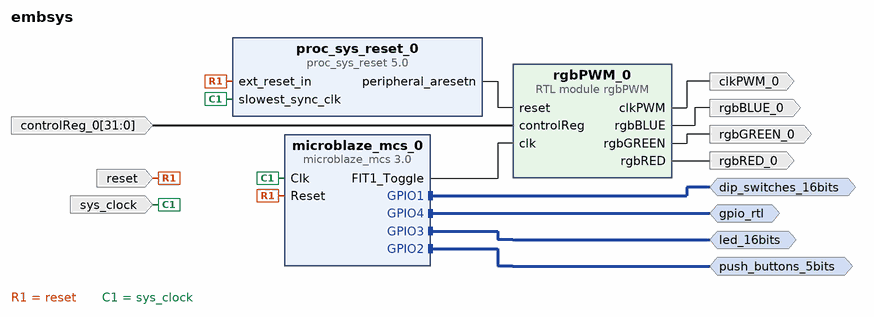
[diagram p0: block diagram of the top level]
# Vivado block design embsys, xc7a100tcsg324-1, Vivado 2024.1
create_bd_design embsys

create_bd_intf_port -mode Master -vlnv xilinx.com:interface:gpio_rtl:1.0 dip_switches_16bits
create_bd_intf_port -mode Master -vlnv xilinx.com:interface:gpio_rtl:1.0 push_buttons_5bits
create_bd_intf_port -mode Master -vlnv xilinx.com:interface:gpio_rtl:1.0 led_16bits
create_bd_intf_port -mode Master -vlnv xilinx.com:interface:gpio_rtl:1.0 gpio_rtl
create_bd_port -dir I -type clk sys_clock
set_property -dict {CONFIG.FREQ_HZ 100000000 CONFIG.PHASE 0.0} [get_bd_ports sys_clock]
create_bd_port -dir I -type rst reset
set_property -dict {CONFIG.POLARITY ACTIVE_LOW} [get_bd_ports reset]
create_bd_port -dir O clkPWM_0
create_bd_port -dir I -from 31 -to 0 controlReg_0
create_bd_port -dir O rgbBLUE_0
create_bd_port -dir O rgbGREEN_0
create_bd_port -dir O rgbRED_0

create_bd_cell -type ip -vlnv xilinx.com:ip:microblaze_mcs:3.0 microblaze_mcs_0
set_property -dict [list \
  CONFIG.CLK_BOARD_INTERFACE sys_clock \
  CONFIG.DEBUG_ENABLED 2 \
  CONFIG.FIT1_No_CLOCKS 500 \
  CONFIG.GPIO1_BOARD_INTERFACE dip_switches_16bits \
  CONFIG.GPIO2_BOARD_INTERFACE push_buttons_5bits \
  CONFIG.GPIO3_BOARD_INTERFACE led_16bits \
  CONFIG.GPIO4_BOARD_INTERFACE Custom \
  CONFIG.MEMSIZE 32768 \
  CONFIG.RESET_BOARD_INTERFACE reset \
  CONFIG.USE_BOARD_FLOW true \
  CONFIG.USE_FIT1 1 \
  CONFIG.USE_GPI4 0 \
  CONFIG.USE_GPO4 1 \
] [get_bd_cells microblaze_mcs_0]
create_bd_cell -type module -reference rgbPWM rgbPWM_0
create_bd_cell -type ip -vlnv xilinx.com:ip:proc_sys_reset:5.0 proc_sys_reset_0
set_property -dict {CONFIG.RESET_BOARD_INTERFACE reset CONFIG.USE_BOARD_FLOW true} [get_bd_cells proc_sys_reset_0]

# ---- connections ----

connect_bd_intf_net [get_bd_intf_ports dip_switches_16bits] [get_bd_intf_pins microblaze_mcs_0/GPIO1]
connect_bd_intf_net [get_bd_intf_ports push_buttons_5bits] [get_bd_intf_pins microblaze_mcs_0/GPIO2]
connect_bd_intf_net [get_bd_intf_ports led_16bits] [get_bd_intf_pins microblaze_mcs_0/GPIO3]
connect_bd_intf_net [get_bd_intf_ports gpio_rtl] [get_bd_intf_pins microblaze_mcs_0/GPIO4]
connect_bd_net -net controlReg_0_1 [get_bd_ports controlReg_0] [get_bd_pins rgbPWM_0/controlReg]
connect_bd_net [get_bd_pins microblaze_mcs_0/FIT1_Toggle] [get_bd_pins rgbPWM_0/clk]
connect_bd_net [get_bd_pins proc_sys_reset_0/peripheral_aresetn] [get_bd_pins rgbPWM_0/reset]
connect_bd_net [get_bd_ports reset] [get_bd_pins microblaze_mcs_0/Reset] [get_bd_pins proc_sys_reset_0/ext_reset_in]
connect_bd_net [get_bd_pins rgbPWM_0/clkPWM] [get_bd_ports clkPWM_0]
connect_bd_net [get_bd_pins rgbPWM_0/rgbBLUE] [get_bd_ports rgbBLUE_0]
connect_bd_net [get_bd_pins rgbPWM_0/rgbGREEN] [get_bd_ports rgbGREEN_0]
connect_bd_net [get_bd_pins rgbPWM_0/rgbRED] [get_bd_ports rgbRED_0]
connect_bd_net [get_bd_ports sys_clock] [get_bd_pins microblaze_mcs_0/Clk] [get_bd_pins proc_sys_reset_0/slowest_sync_clk]

validate_bd_design
save_bd_design
